# EAGLE schematic whisker_module_1 (EAGLE 6.3)
Proximity Module -- manages data from 8 external bumpers and 3 ultrasonic sensors. All bumper inputs are sent through a low-pass filter (0.1uF cap) and a schmitt trigger/inverter to smooth the signals. This module is a 5V system that uses a custom level converter for the SDA and SCL lines to make the 5V system work with the 3.3V systems. The ultrasonic sensors are connected directly to a digital pin. All power in this system is smoothed for low-pass and high-pass noise.
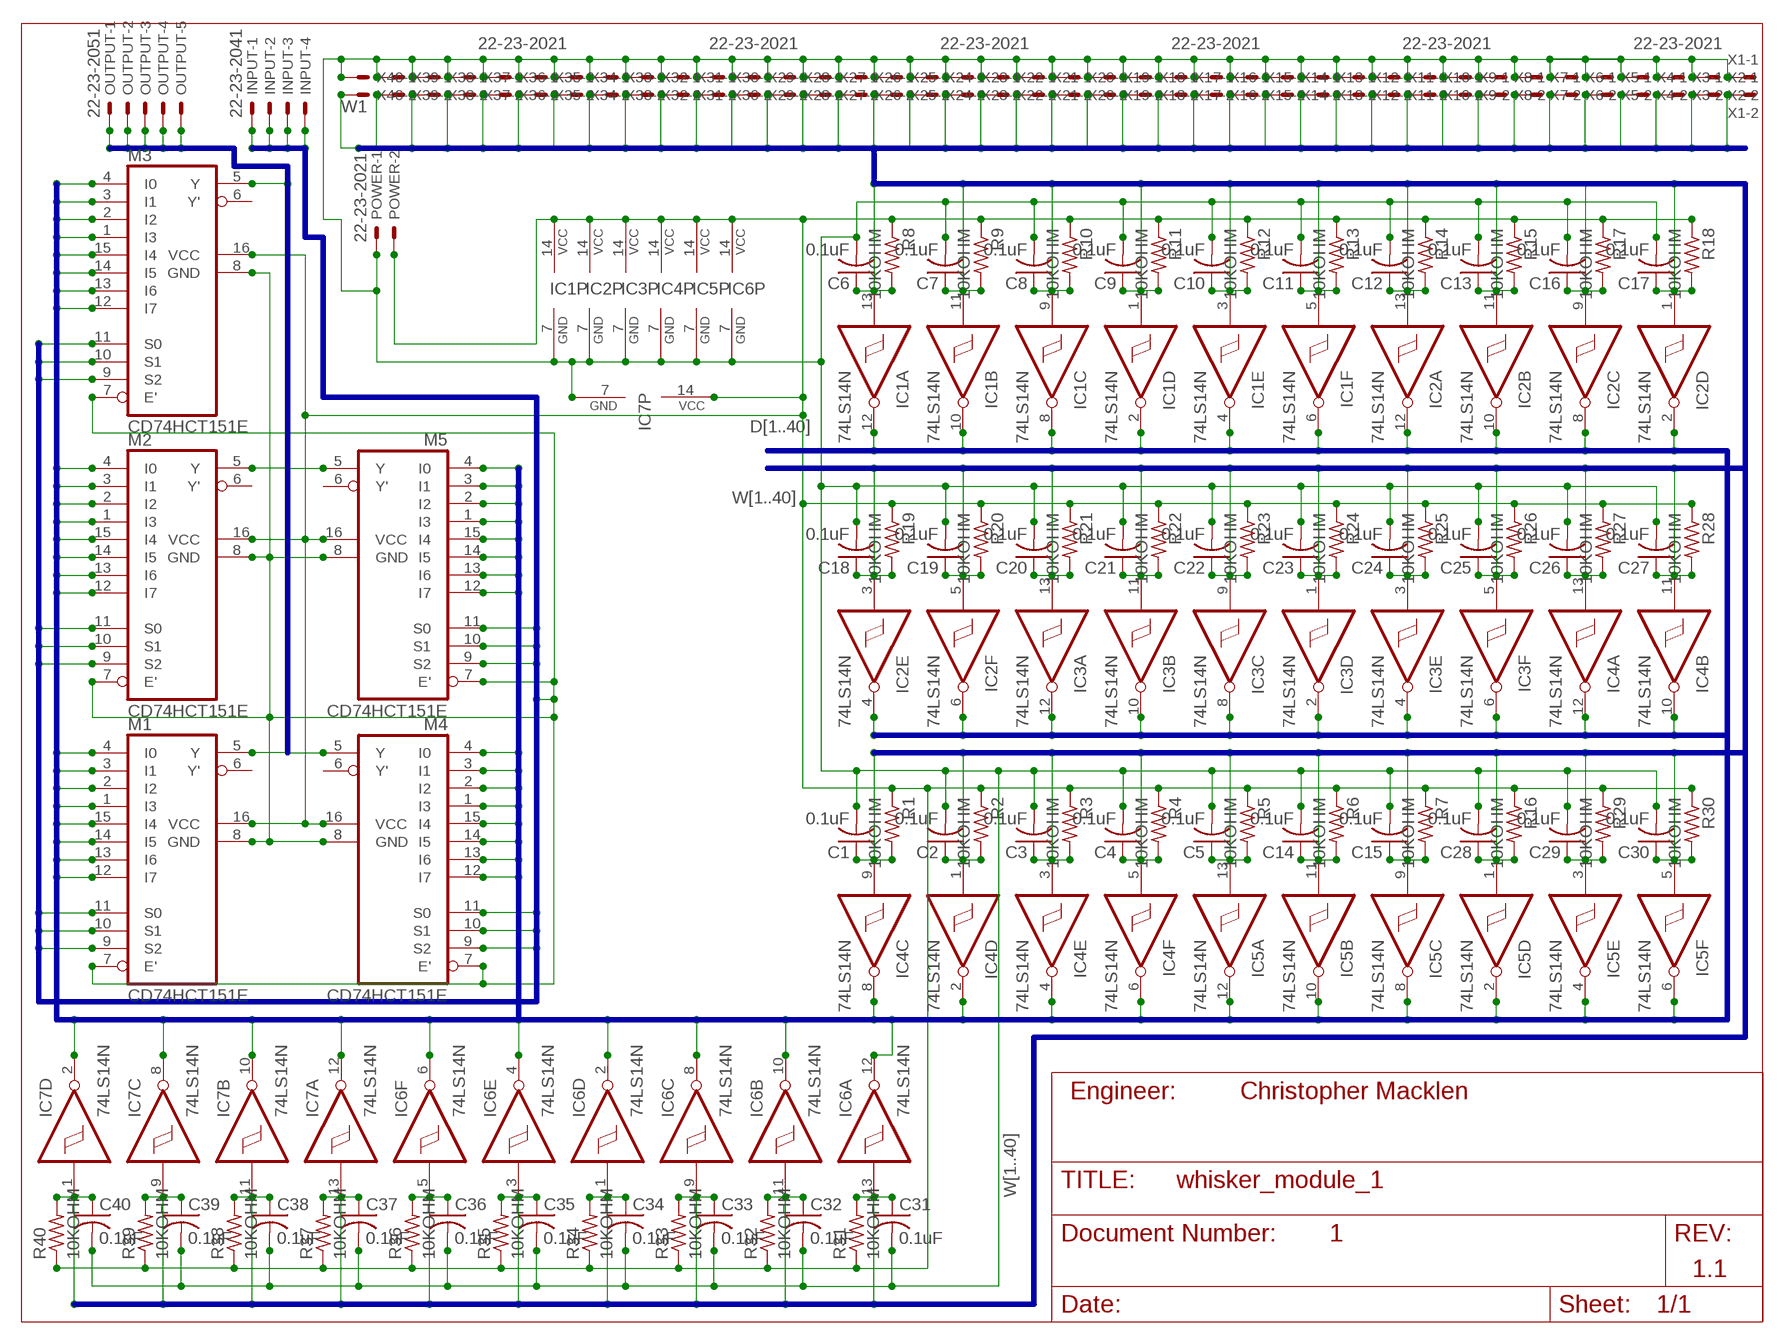
[diagram p0: schematic, sheet 1]

## Parts
C1  0.1uF  C-US025-024X044  [C025-024X044]
C2  0.1uF  C-US025-024X044  [C025-024X044]
C3  0.1uF  C-US025-024X044  [C025-024X044]
C4  0.1uF  C-US025-024X044  [C025-024X044]
C5  0.1uF  C-US025-024X044  [C025-024X044]
C6  0.1uF  C-US025-024X044  [C025-024X044]
C7  0.1uF  C-US025-024X044  [C025-024X044]
C8  0.1uF  C-US025-024X044  [C025-024X044]
C9  0.1uF  C-US025-024X044  [C025-024X044]
C10  0.1uF  C-US025-024X044  [C025-024X044]
C11  0.1uF  C-US025-024X044  [C025-024X044]
C12  0.1uF  C-US025-024X044  [C025-024X044]
C13  0.1uF  C-US025-024X044  [C025-024X044]
C14  0.1uF  C-US025-024X044  [C025-024X044]
C15  0.1uF  C-US025-024X044  [C025-024X044]
C16  0.1uF  C-US025-024X044  [C025-024X044]
C17  0.1uF  C-US025-024X044  [C025-024X044]
C18  0.1uF  C-US025-024X044  [C025-024X044]
C19  0.1uF  C-US025-024X044  [C025-024X044]
C20  0.1uF  C-US025-024X044  [C025-024X044]
C21  0.1uF  C-US025-024X044  [C025-024X044]
C22  0.1uF  C-US025-024X044  [C025-024X044]
C23  0.1uF  C-US025-024X044  [C025-024X044]
C24  0.1uF  C-US025-024X044  [C025-024X044]
C25  0.1uF  C-US025-024X044  [C025-024X044]
C26  0.1uF  C-US025-024X044  [C025-024X044]
C27  0.1uF  C-US025-024X044  [C025-024X044]
C28  0.1uF  C-US025-024X044  [C025-024X044]
C29  0.1uF  C-US025-024X044  [C025-024X044]
C30  0.1uF  C-US025-024X044  [C025-024X044]
C31  0.1uF  C-US025-024X044  [C025-024X044]
C32  0.1uF  C-US025-024X044  [C025-024X044]
C33  0.1uF  C-US025-024X044  [C025-024X044]
C34  0.1uF  C-US025-024X044  [C025-024X044]
C35  0.1uF  C-US025-024X044  [C025-024X044]
C36  0.1uF  C-US025-024X044  [C025-024X044]
C37  0.1uF  C-US025-024X044  [C025-024X044]
C38  0.1uF  C-US025-024X044  [C025-024X044]
C39  0.1uF  C-US025-024X044  [C025-024X044]
C40  0.1uF  C-US025-024X044  [C025-024X044]
IC1  74LS14N  [DIL14]
IC2  74LS14N  [DIL14]
IC3  74LS14N  [DIL14]
IC4  74LS14N  [DIL14]
IC5  74LS14N  [DIL14]
IC6  74LS14N  [DIL14]
IC7  74LS14N  [DIL14]
INPUT  22-23-2041  [22-23-2041]
M1  CD74HCT151E  [CD74HCT151E]
M2  CD74HCT151E  [CD74HCT151E]
M3  CD74HCT151E  [CD74HCT151E]
M4  CD74HCT151E  [CD74HCT151E]
M5  CD74HCT151E  [CD74HCT151E]
OUTPUT  22-23-2051  [22-23-2051]
POWER  22-23-2021  [22-23-2021]
R1  10KOHM  R-US_0204/7  [0204/7]
R2  10KOHM  R-US_0204/7  [0204/7]
R3  10KOHM  R-US_0204/7  [0204/7]
R4  10KOHM  R-US_0204/7  [0204/7]
R5  10KOHM  R-US_0204/7  [0204/7]
R6  10KOHM  R-US_0204/7  [0204/7]
R7  10KOHM  R-US_0204/7  [0204/7]
R8  10KOHM  R-US_0204/7  [0204/7]
R9  10KOHM  R-US_0204/7  [0204/7]
R10  10KOHM  R-US_0204/7  [0204/7]
R11  10KOHM  R-US_0204/7  [0204/7]
R12  10KOHM  R-US_0204/7  [0204/7]
R13  10KOHM  R-US_0204/7  [0204/7]
R14  10KOHM  R-US_0204/7  [0204/7]
R15  10KOHM  R-US_0204/7  [0204/7]
R16  10KOHM  R-US_0204/7  [0204/7]
R17  10KOHM  R-US_0204/7  [0204/7]
R18  10KOHM  R-US_0204/7  [0204/7]
R19  10KOHM  R-US_0204/7  [0204/7]
R20  10KOHM  R-US_0204/7  [0204/7]
R21  10KOHM  R-US_0204/7  [0204/7]
R22  10KOHM  R-US_0204/7  [0204/7]
R23  10KOHM  R-US_0204/7  [0204/7]
R24  10KOHM  R-US_0204/7  [0204/7]
R25  10KOHM  R-US_0204/7  [0204/7]
R26  10KOHM  R-US_0204/7  [0204/7]
R27  10KOHM  R-US_0204/7  [0204/7]
R28  10KOHM  R-US_0204/7  [0204/7]
R29  10KOHM  R-US_0204/7  [0204/7]
R30  10KOHM  R-US_0204/7  [0204/7]
R31  10KOHM  R-US_0204/7  [0204/7]
R32  10KOHM  R-US_0204/7  [0204/7]
R33  10KOHM  R-US_0204/7  [0204/7]
R34  10KOHM  R-US_0204/7  [0204/7]
R35  10KOHM  R-US_0204/7  [0204/7]
R36  10KOHM  R-US_0204/7  [0204/7]
R37  10KOHM  R-US_0204/7  [0204/7]
R38  10KOHM  R-US_0204/7  [0204/7]
R39  10KOHM  R-US_0204/7  [0204/7]
R40  10KOHM  R-US_0204/7  [0204/7]
X1  22-23-2021  [22-23-2021]
X2  22-23-2021  [22-23-2021]
X3  22-23-2021  [22-23-2021]
X4  22-23-2021  [22-23-2021]
X5  22-23-2021  [22-23-2021]
X6  22-23-2021  [22-23-2021]
X7  22-23-2021  [22-23-2021]
X8  22-23-2021  [22-23-2021]
X9  22-23-2021  [22-23-2021]
X10  22-23-2021  [22-23-2021]
X11  22-23-2021  [22-23-2021]
X12  22-23-2021  [22-23-2021]
X13  22-23-2021  [22-23-2021]
X14  22-23-2021  [22-23-2021]
X15  22-23-2021  [22-23-2021]
X16  22-23-2021  [22-23-2021]
X17  22-23-2021  [22-23-2021]
X18  22-23-2021  [22-23-2021]
X19  22-23-2021  [22-23-2021]
X20  22-23-2021  [22-23-2021]
X21  22-23-2021  [22-23-2021]
X22  22-23-2021  [22-23-2021]
X23  22-23-2021  [22-23-2021]
X24  22-23-2021  [22-23-2021]
X25  22-23-2021  [22-23-2021]
X26  22-23-2021  [22-23-2021]
X27  22-23-2021  [22-23-2021]
X28  22-23-2021  [22-23-2021]
X29  22-23-2021  [22-23-2021]
X30  22-23-2021  [22-23-2021]
X31  22-23-2021  [22-23-2021]
X32  22-23-2021  [22-23-2021]
X33  22-23-2021  [22-23-2021]
X34  22-23-2021  [22-23-2021]
X35  22-23-2021  [22-23-2021]
X36  22-23-2021  [22-23-2021]
X37  22-23-2021  [22-23-2021]
X38  22-23-2021  [22-23-2021]
X39  22-23-2021  [22-23-2021]
X40  22-23-2021  [22-23-2021]

## Nets
5V: IC1.14(P:VCC) IC2.14(P:VCC) IC3.14(P:VCC) IC4.14(P:VCC) IC5.14(P:VCC) IC6.14(P:VCC) IC7.14(P:VCC) M1.16(VCC) M2.16(VCC) M3.16(VCC) M4.16(VCC) M5.16(VCC) POWER.2 R1.1 R2.1 R3.1 R4.1 R5.1 R6.1 R7.1 R8.1 R9.1 R10.1 R11.1 R12.1 R13.1 R14.1 R15.1 R16.1 R17.1 R18.1 R19.1 R20.1 R21.1 R22.1 R23.1 R24.1 R25.1 R26.1 R27.1 R28.1 R29.1 R30.1 R31.1 R32.1 R33.1 R34.1 R35.1 R36.1 R37.1 R38.1 R39.1 R40.1
D1: IC1.12(A:O) M1.4(I0)
D2: IC1.10(B:O) M4.4(I0)
D3: IC1.8(C:O) M2.4(I0)
D4: IC1.2(D:O) M5.4(I0)
D5: IC1.4(E:O) M3.4(I0)
D6: IC1.6(F:O) M1.3(I1)
D7: IC2.12(A:O) M4.3(I1)
D8: IC2.10(B:O) M2.3(I1)
D9: IC2.8(C:O) M5.3(I1)
D10: IC2.2(D:O) M3.3(I1)
D11: IC2.4(E:O) M1.2(I2)
D12: IC2.6(F:O) M4.2(I2)
D13: IC3.12(A:O) M2.2(I2)
D14: IC3.10(B:O) M5.2(I2)
D15: IC3.8(C:O) M3.2(I2)
D16: IC3.2(D:O) M1.1(I3)
D17: IC3.4(E:O) M4.1(I3)
D18: IC3.6(F:O) M2.1(I3)
D19: IC4.12(A:O) M5.1(I3)
D20: IC4.10(B:O) M3.1(I3)
D21: IC4.8(C:O) M1.15(I4)
D22: IC4.2(D:O) M4.15(I4)
D23: IC4.4(E:O) M2.15(I4)
D24: IC4.6(F:O) M5.15(I4)
D25: IC5.12(A:O) M3.15(I4)
D26: IC5.10(B:O) M1.14(I5)
D27: IC5.8(C:O) M4.14(I5)
D28: IC5.2(D:O) M2.14(I5)
D29: IC5.4(E:O) M5.14(I5)
D30: IC5.6(F:O) M3.14(I5)
D31: IC6.12(A:O) M1.13(I6)
D32: IC6.10(B:O) M4.13(I6)
D33: IC6.8(C:O) M2.13(I6)
D34: IC6.2(D:O) M5.13(I6)
D35: IC6.4(E:O) M3.13(I6)
D36: IC6.6(F:O) M1.12(I7)
D37: IC7.12(A:O) M4.12(I7)
D38: IC7.10(B:O) M2.12(I7)
D39: IC7.8(C:O) M5.12(I7)
D40: IC7.2(D:O) M3.12(I7)
GND: C1.2 C2.2 C3.2 C4.2 C5.2 C6.2 C7.2 C8.2 C9.2 C10.2 C11.2 C12.2 C13.2 C14.2 C15.2 C16.2 C17.2 C18.2 C19.2 C20.2 C21.2 C22.2 C23.2 C24.2 C25.2 C26.2 C27.2 C28.2 C29.2 C30.2 C31.2 C32.2 C33.2 C34.2 C35.2 C36.2 C37.2 C38.2 C39.2 C40.2 IC1.7(P:GND) IC2.7(P:GND) IC3.7(P:GND) IC4.7(P:GND) IC5.7(P:GND) IC6.7(P:GND) IC7.7(P:GND) POWER.1 X1.1 X2.1 X3.1 X4.1 X5.1 X6.1 X7.1 X8.1 X9.1 X10.1 X11.1 X12.1 X13.1 X14.1 X15.1 X16.1 X17.1 X18.1 X19.1 X20.1 X21.1 X22.1 X23.1 X24.1 X25.1 X26.1 X27.1 X28.1 X29.1 X30.1 X31.1 X32.1 X33.1 X34.1 X35.1 X36.1 X37.1 X38.1 X39.1 X40.1
OUTPUT1: M1.5(Y) OUTPUT.1
OUTPUT2: M4.5(Y) OUTPUT.2
OUTPUT3: M2.5(Y) OUTPUT.3
OUTPUT4: M5.5(Y) OUTPUT.4
OUTPUT5: M3.5(Y) OUTPUT.5
SELECT1: INPUT.1 M1.11(S0) M2.11(S0) M3.11(S0) M4.11(S0) M5.10(S1) M5.11(S0)
SELECT2: INPUT.2 M1.10(S1) M2.10(S1) M3.9(S2) M3.10(S1) M4.10(S1)
SELECT3: INPUT.3 M1.9(S2) M2.9(S2) M4.9(S2) M5.9(S2)
SELECT4: INPUT.4 M1.7(E') M1.8(GND) M2.7(E') M2.8(GND) M3.7(E') M3.8(GND) M4.7(E') M4.8(GND) M5.7(E') M5.8(GND)
W1: C6.1 IC1.13(A:I) R8.2 X40.2
W2: C7.1 IC1.11(B:I) R9.2 X39.2
W3: C8.1 IC1.9(C:I) R10.2 X38.2
W4: C9.1 IC1.1(D:I) R11.2 X37.2
W5: C10.1 IC1.3(E:I) R12.2 X36.2
W6: C11.1 IC1.5(F:I) R13.2 X35.2
W7: C12.1 IC2.13(A:I) R14.2 X34.2
W8: C13.1 IC2.11(B:I) R15.2 X33.2
W9: C16.1 IC2.9(C:I) R17.2 X32.2
W10: C17.1 IC2.1(D:I) R18.2 X31.2
W11: C18.1 IC2.3(E:I) R19.2 X30.2
W12: C19.1 IC2.5(F:I) R20.2 X29.2
W13: C20.1 IC3.13(A:I) R21.2 X28.2
W14: C21.1 IC3.11(B:I) R22.2 X27.2
W15: C22.1 IC3.9(C:I) R23.2 X26.2
W16: C23.1 IC3.1(D:I) R24.2 X25.2
W17: C24.1 IC3.3(E:I) R25.2 X24.2
W18: C25.1 IC3.5(F:I) R26.2 X23.2
W19: C26.1 IC4.13(A:I) R27.2 X22.2
W20: C27.1 IC4.11(B:I) R28.2 X21.2
W21: C1.1 IC4.9(C:I) R1.2 X20.2
W22: C2.1 IC4.1(D:I) R2.2 X19.2
W23: C3.1 IC4.3(E:I) R3.2 X18.2
W24: C4.1 IC4.5(F:I) R4.2 X17.2
W25: C5.1 IC5.13(A:I) R5.2 X16.2
W26: C14.1 IC5.11(B:I) R6.2 X15.2
W27: C15.1 IC5.9(C:I) R7.2 X14.2
W28: C28.1 IC5.1(D:I) R16.2 X13.2
W29: C29.1 IC5.3(E:I) R29.2 X12.2
W30: C30.1 IC5.5(F:I) R30.2 X11.2
W31: C31.1 IC6.13(A:I) R31.2 X10.2
W32: C32.1 IC6.11(B:I) R32.2 X9.2
W33: C33.1 IC6.9(C:I) R33.2 X8.2
W34: C34.1 IC6.1(D:I) R34.2 X7.2
W35: C35.1 IC6.3(E:I) R35.2 X6.2
W36: C36.1 IC6.5(F:I) R36.2 X5.2
W37: C37.1 IC7.13(A:I) R37.2 X4.2
W38: C38.1 IC7.11(B:I) R38.2 X3.2
W39: C39.1 IC7.9(C:I) R39.2 X2.2
W40: C40.1 IC7.1(D:I) R40.2 X1.2
Unconnected: IC7.3(E:I) IC7.4(E:O) IC7.5(F:I) IC7.6(F:O) M1.6(Y') M2.6(Y') M3.6(Y') M4.6(Y') M5.6(Y')

## Buses
W[1..40]
D[1..40]
OUTPUT[1..5]
SELECT[1..4]

## Notes on the sheet
- W1
- Engineer: | Christopher Macklen
- 1
- 1.1

## Library data of the parts
C1-C40 = rcl:C-US: CAPACITOR, American symbol
IC1-IC7 = 74xx-us:74*14: Hex schmitt trigger INVERTER
INPUT = con-molex:22-23-2041: .100" (2.54mm) Center Header - 4 Pin; MF: MOLEX; MPN: 22-23-2041; OC_FARNELL: 1462920; OC_NEWARK: 38C0355
M1-M5 = Custom:CD74HCT151E
OUTPUT = con-molex:22-23-2051: .100" (2.54mm) Center Header - 5 Pin; MF: MOLEX; MPN: 22-23-2051; OC_FARNELL: 1462952; OC_NEWARK: 38C9178
POWER X1-X40 = con-molex:22-23-2021: .100" (2.54mm) Center Header - 2 Pin; MF: MOLEX; MPN: 22-23-2021; OC_FARNELL: 1462926; OC_NEWARK: 25C3832
R1-R40 = rcl:R-US_: RESISTOR, American symbol